# Altium schematic sheet LCD.SchDoc
size A4
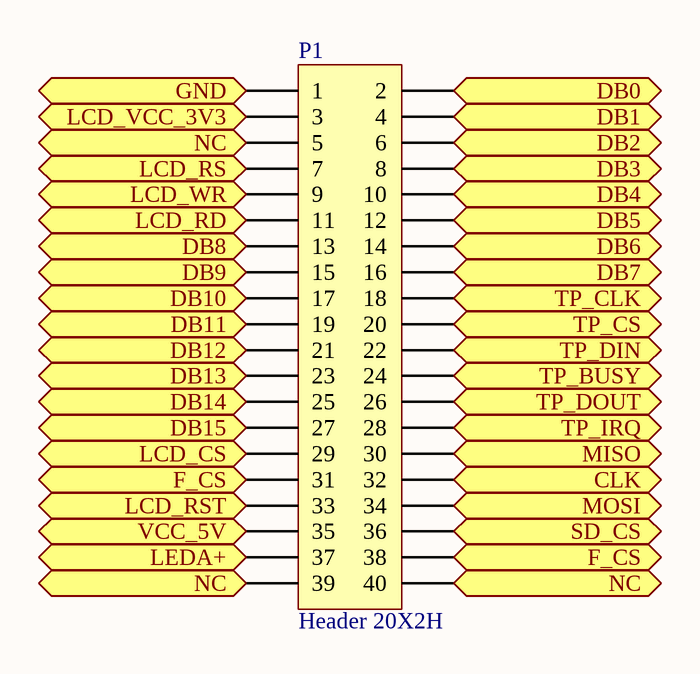
[diagram p0: LCD.SchDoc]

## Parts
P1  Header 20X2H  [HDR2X20H]

## Ports
CLK, DB0, DB1, DB2, DB3, DB4, DB5, DB6, DB7, DB8, DB9, DB10, DB11, DB12, DB13, DB14, DB15, F_CS, GND, LCD_CS, LCD_RD, LCD_RS, LCD_RST, LCD_VCC_3V3, LCD_WR, LEDA+, MISO, MOSI, NC, SD_CS, TP_BUSY, TP_CLK, TP_CS, TP_DIN, TP_DOUT, TP_IRQ, VCC_5V

## Nets
CLK: P1.32 ; port CLK
DB0: P1.2 ; port DB0
DB1: P1.4 ; port DB1
DB2: P1.6 ; port DB2
DB3: P1.8 ; port DB3
DB4: P1.10 ; port DB4
DB5: P1.12 ; port DB5
DB6: P1.14 ; port DB6
DB7: P1.16 ; port DB7
DB8: P1.13 ; port DB8
DB9: P1.15 ; port DB9
DB10: P1.17 ; port DB10
DB11: P1.19 ; port DB11
DB12: P1.21 ; port DB12
DB13: P1.23 ; port DB13
DB14: P1.25 ; port DB14
DB15: P1.27 ; port DB15
F_CS: P1.31 P1.38 ; port F_CS
GND: P1.1 ; port GND
LCD_CS: P1.29 ; port LCD_CS
LCD_RD: P1.11 ; port LCD_RD
LCD_RS: P1.7 ; port LCD_RS
LCD_RST: P1.33 ; port LCD_RST
LCD_VCC_3V3: P1.3 ; port LCD_VCC_3V3
LCD_WR: P1.9 ; port LCD_WR
LEDA+: P1.37 ; port LEDA+
MISO: P1.30 ; port MISO
MOSI: P1.34 ; port MOSI
NC: P1.5 P1.39 P1.40 ; port NC
SD_CS: P1.36 ; port SD_CS
TP_BUSY: P1.24 ; port TP_BUSY
TP_CLK: P1.18 ; port TP_CLK
TP_CS: P1.20 ; port TP_CS
TP_DIN: P1.22 ; port TP_DIN
TP_DOUT: P1.26 ; port TP_DOUT
TP_IRQ: P1.28 ; port TP_IRQ
VCC_5V: P1.35 ; port VCC_5V

## Library data of the parts
P1 = Header 20X2H: Header, 20-Pin, Dual row, Right Angle; LatestRevisionDate: 17-Jul-2002; LatestRevisionNote: Re-released for DXP Platform.; Publisher: Altium Limited